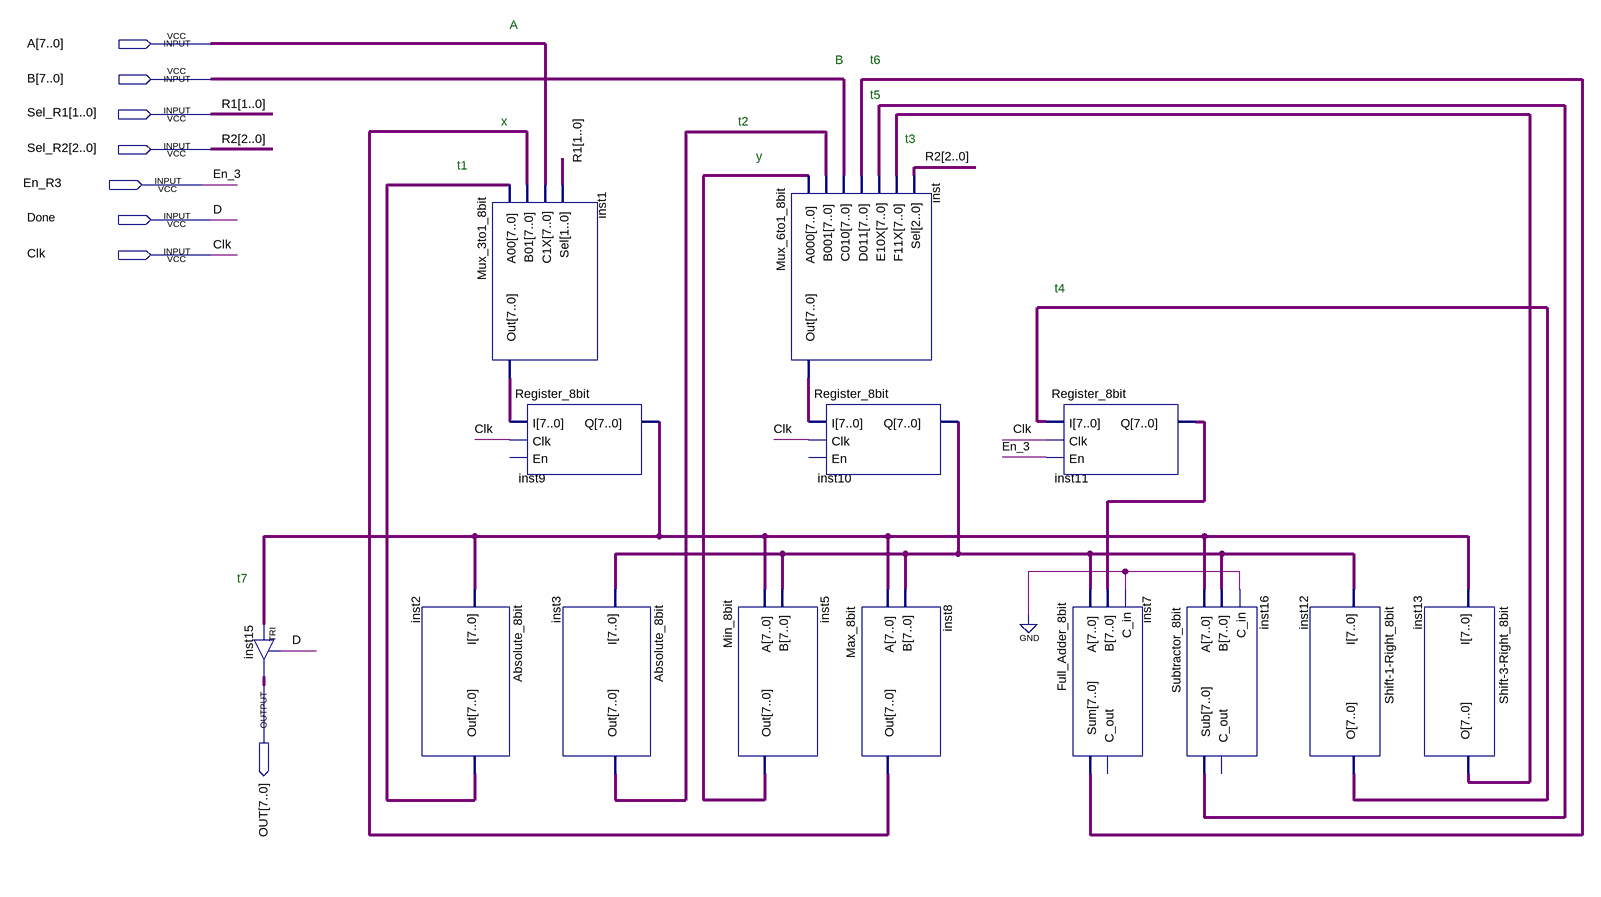
[diagram p0: schematic sheet]
// Quartus schematic Datapath.bdf as structural Verilog: 14 symbols, 8 pins
module Datapath (
  input  [7:0] A,
  input  [7:0] B,
  input  [1:0] Sel_R1,
  input  [2:0] Sel_R2,
  input  En_R3,
  input  Done,
  input  Clk,
  output [7:0] OUT
);

  wire [7:0] inst1_out, inst2_out, inst3_out, inst5_out, inst7_sum, inst8_out, inst9_q, inst10_q, inst11_q,
       inst12_o, inst13_o, inst16_sub, inst_out;

  TRI inst15[7:0] (.IN(inst9_q), .OE(Done), .OUT(OUT));
  Absolute_8bit inst2 (.I(inst9_q), .Out(inst2_out));
  Mux_3to1_8bit inst1 (.A00(inst2_out), .B01(inst8_out), .C1X(A), .Sel(Sel_R1), .Out(inst1_out));
  Register_8bit inst9 (.I(inst1_out), .Clk(Clk), .Q(inst9_q));  // open: En
  Absolute_8bit inst3 (.I(inst10_q), .Out(inst3_out));
  Min_8bit inst5 (.A(inst9_q), .B(inst10_q), .Out(inst5_out));
  Mux_6to1_8bit inst (
    .A000(inst5_out), .B001(inst3_out), .C010(B), .D011(inst7_sum), .E10X(inst16_sub), .F11X(inst13_o),
    .Sel(Sel_R2), .Out(inst_out));
  Register_8bit inst10 (.I(inst_out), .Clk(Clk), .Q(inst10_q));  // open: En
  Max_8bit inst8 (.A(inst9_q), .B(inst10_q), .Out(inst8_out));
  Register_8bit inst11 (.I(inst12_o), .Clk(Clk), .En(En_R3), .Q(inst11_q));
  Full_Adder_8bit inst7 (.A(inst10_q), .B(inst11_q), .C_in(1'b0), .Sum(inst7_sum));  // open: C_out
  Subtractor_8bit inst16 (.A(inst9_q), .B(inst10_q), .C_in(1'b0), .Sub(inst16_sub));  // open: C_out
  \Shift-1-Right_8bit  inst12 (.I(inst10_q), .O(inst12_o));
  \Shift-3-Right_8bit  inst13 (.I(inst9_q), .O(inst13_o));

  // Other names for the same wires on the sheet: D = Done; En_3 = En_R3; R1[1:0] = Sel_R1; R2[2:0] = Sel_R2

  // Notes on the sheet:
  //   A
  //   B
  //   t6
  //   t5
  //   x
  //   t2
  //   t3
  //   y
  //   t1
  //   t4
  //   t7
endmodule
